# EAGLE design version1_3 (EAGLE 6.4)
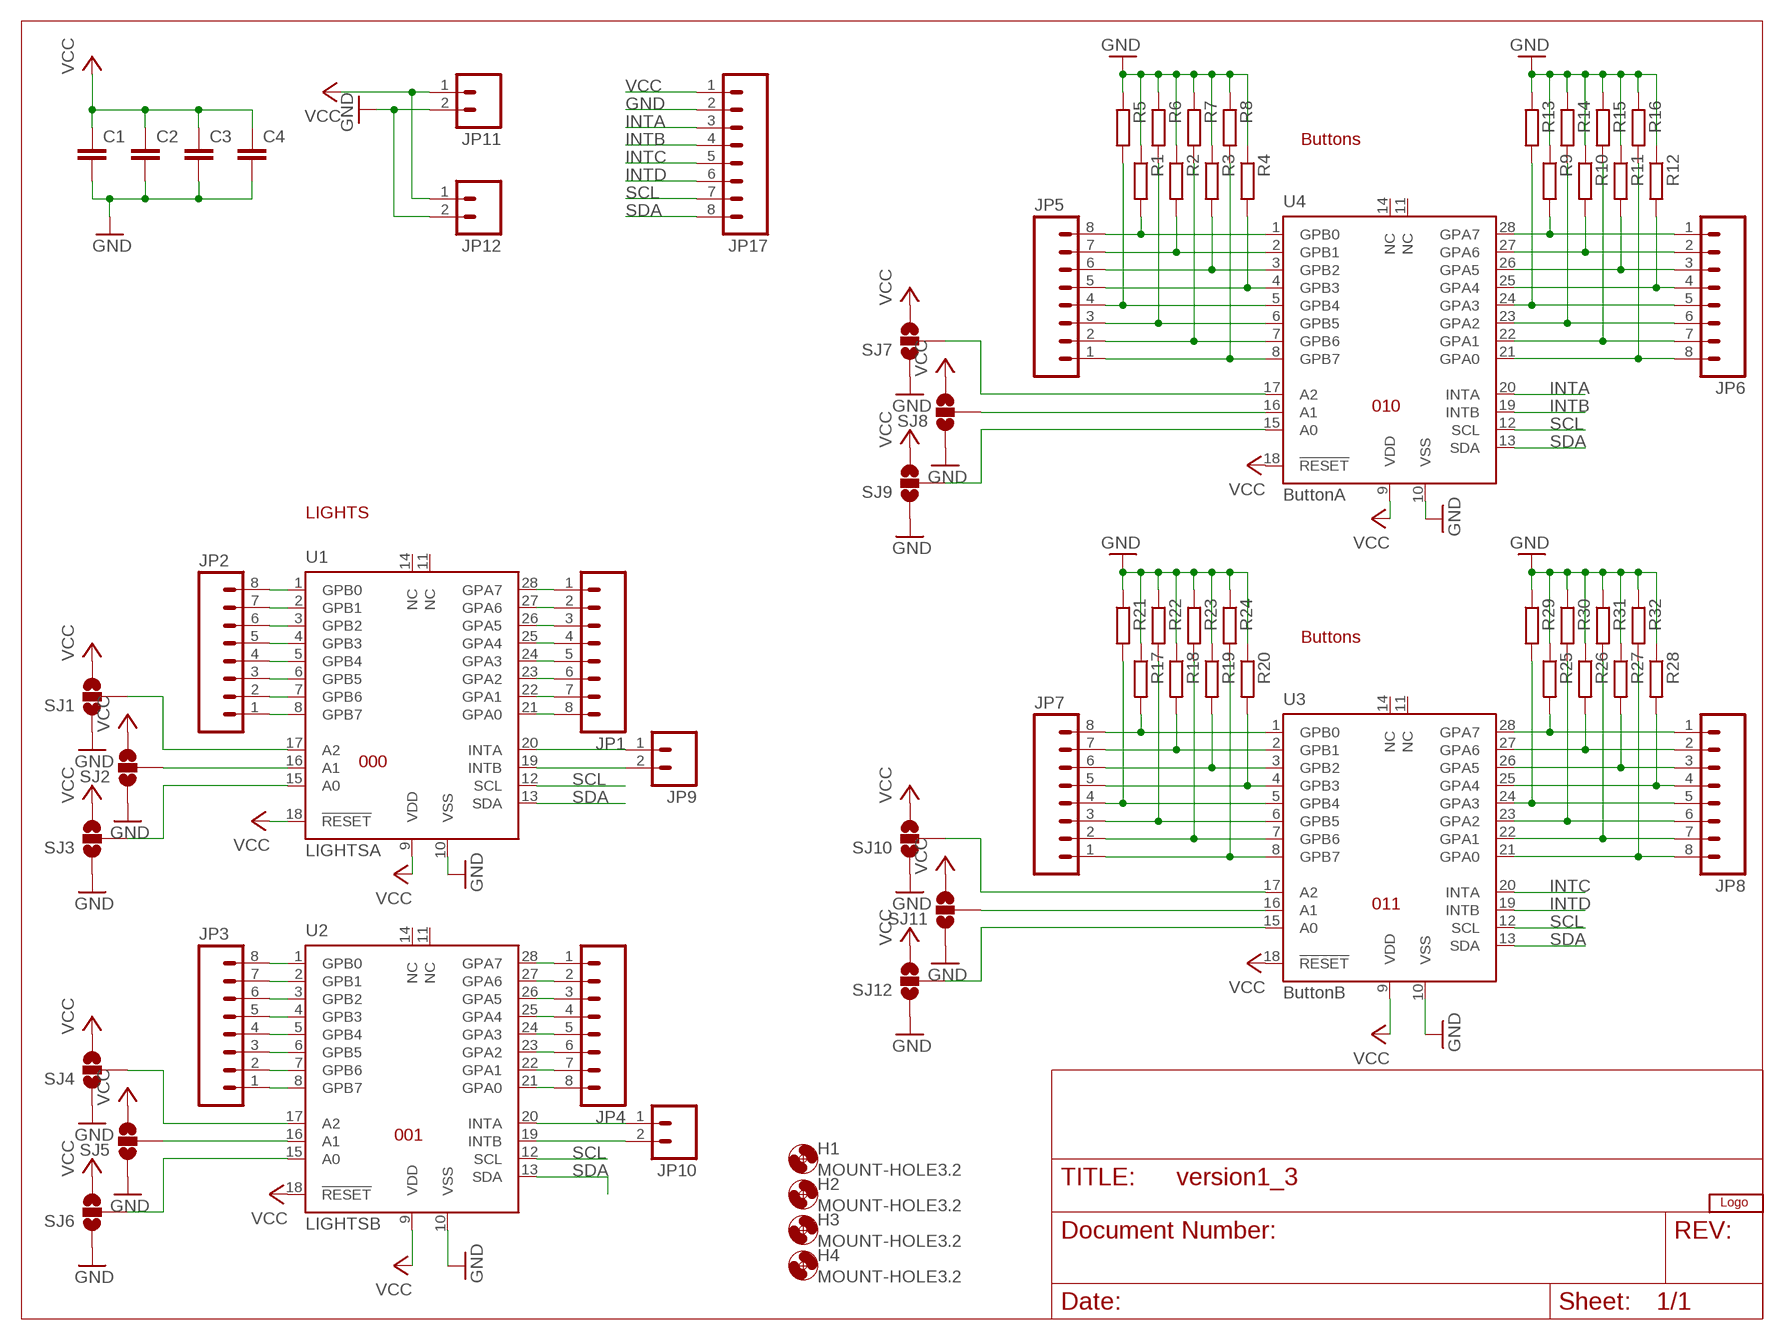
[diagram p0: schematic, sheet 1]

## Parts
C1  C-EUC0805  [C0805]
C2  C-EUC0805  [C0805]
C3  C-EUC0805  [C0805]
C4  C-EUC0805  [C0805]
H1  MOUNT-HOLE3.2  [3,2]
H2  MOUNT-HOLE3.2  [3,2]
H3  MOUNT-HOLE3.2  [3,2]
H4  MOUNT-HOLE3.2  [3,2]
JP1  M08LOCK  [1X08_LOCK]
JP2  M08LOCK  [1X08_LOCK]
JP3  M08LOCK  [1X08_LOCK]
JP4  M08LOCK  [1X08_LOCK]
JP5  M08LOCK  [1X08_LOCK]
JP6  M08LOCK  [1X08_LOCK]
JP7  M08LOCK  [1X08_LOCK]
JP8  M08LOCK  [1X08_LOCK]
JP9  M021X02_NO_SILK  [1X02_NO_SILK]
JP10  M021X02_NO_SILK  [1X02_NO_SILK]
JP11  M021X02_NO_SILK  [1X02_NO_SILK]
JP12  M021X02_NO_SILK  [1X02_NO_SILK]
JP17  M08LOCK  [1X08_LOCK]
R1  R-EU_R0805  [R0805]
R2  R-EU_R0805  [R0805]
R3  R-EU_R0805  [R0805]
R4  R-EU_R0805  [R0805]
R5  R-EU_R0805  [R0805]
R6  R-EU_R0805  [R0805]
R7  R-EU_R0805  [R0805]
R8  R-EU_R0805  [R0805]
R9  R-EU_R0805  [R0805]
R10  R-EU_R0805  [R0805]
R11  R-EU_R0805  [R0805]
R12  R-EU_R0805  [R0805]
R13  R-EU_R0805  [R0805]
R14  R-EU_R0805  [R0805]
R15  R-EU_R0805  [R0805]
R16  R-EU_R0805  [R0805]
R17  R-EU_R0805  [R0805]
R18  R-EU_R0805  [R0805]
R19  R-EU_R0805  [R0805]
R20  R-EU_R0805  [R0805]
R21  R-EU_R0805  [R0805]
R22  R-EU_R0805  [R0805]
R23  R-EU_R0805  [R0805]
R24  R-EU_R0805  [R0805]
R25  R-EU_R0805  [R0805]
R26  R-EU_R0805  [R0805]
R27  R-EU_R0805  [R0805]
R28  R-EU_R0805  [R0805]
R29  R-EU_R0805  [R0805]
R30  R-EU_R0805  [R0805]
R31  R-EU_R0805  [R0805]
R32  R-EU_R0805  [R0805]
SJ1  SOLDERJUMPER_2WAY-OLDS  [SJ_3]
SJ2  SOLDERJUMPER_2WAY-OLDS  [SJ_3]
SJ3  SOLDERJUMPER_2WAY-OLDS  [SJ_3]
SJ4  SOLDERJUMPER_2WAY-OLDS  [SJ_3]
SJ5  SOLDERJUMPER_2WAY-OLDS  [SJ_3]
SJ6  SOLDERJUMPER_2WAY-OLDS  [SJ_3]
SJ7  SOLDERJUMPER_2WAY-OLDS  [SJ_3]
SJ8  SOLDERJUMPER_2WAY-OLDS  [SJ_3]
SJ9  SOLDERJUMPER_2WAY-OLDS  [SJ_3]
SJ10  SOLDERJUMPER_2WAY-OLDS  [SJ_3]
SJ11  SOLDERJUMPER_2WAY-OLDS  [SJ_3]
SJ12  SOLDERJUMPER_2WAY-OLDS  [SJ_3]
U1  LIGHTSA  MCP23017A  [MCP23017A]
U2  LIGHTSB  MCP23017A  [MCP23017A]
U3  ButtonB  MCP23017A  [MCP23017A]
U4  ButtonA  MCP23017A  [MCP23017A]
U$1  BUNNYLOGOCALVIN2  [CALVIN2]

## Nets
GND [power]: C1.2 C2.2 C3.2 C4.2 JP11.2 JP12.2 JP17.2 R1.1 R2.1 R3.1 R4.1 R5.1 R6.1 R7.1 R8.1 R9.1 R10.1 R11.1 R12.1 R13.1 R14.1 R15.1 R16.1 R17.1 R18.1 R19.1 R20.1 R21.1 R22.1 R23.1 R24.1 R25.1 R26.1 R27.1 R28.1 R29.1 R30.1 R31.1 R32.1 SJ1.1 SJ2.1 SJ3.1 SJ4.1 SJ5.1 SJ6.1 SJ7.1 SJ8.1 SJ9.1 SJ10.1 SJ11.1 SJ12.1 U1.10(VSS) U2.10(VSS) U3.10(VSS) U4.10(VSS)
INTA: JP17.3 U4.20(INTA)
INTB: JP17.4 U4.19(INTB)
INTC: JP17.5 U3.20(INTA)
INTD: JP17.6 U3.19(INTB)
N$1: JP1.1 U1.28(GPA7)
N$2: JP1.2 U1.27(GPA6)
N$3: JP1.3 U1.26(GPA5)
N$4: JP1.4 U1.25(GPA4)
N$5: JP1.5 U1.24(GPA3)
N$6: JP1.6 U1.23(GPA2)
N$7: JP1.7 U1.22(GPA1)
N$8: JP1.8 U1.21(GPA0)
N$9: JP2.1 U1.8(GPB7)
N$10: JP2.2 U1.7(GPB6)
N$11: JP2.3 U1.6(GPB5)
N$12: JP2.4 U1.5(GPB4)
N$13: JP2.5 U1.4(GPB3)
N$14: JP2.6 U1.3(GPB2)
N$15: JP2.7 U1.2(GPB1)
N$16: JP2.8 U1.1(GPB0)
N$17: JP3.1 U2.8(GPB7)
N$18: JP3.2 U2.7(GPB6)
N$19: JP3.3 U2.6(GPB5)
N$20: JP3.4 U2.5(GPB4)
N$21: JP3.5 U2.4(GPB3)
N$22: JP3.6 U2.3(GPB2)
N$23: JP3.7 U2.2(GPB1)
N$24: JP3.8 U2.1(GPB0)
N$25: JP4.1 U2.28(GPA7)
N$26: JP4.2 U2.27(GPA6)
N$27: JP4.3 U2.26(GPA5)
N$28: JP4.4 U2.25(GPA4)
N$29: JP4.5 U2.24(GPA3)
N$30: JP4.6 U2.23(GPA2)
N$31: JP4.7 U2.22(GPA1)
N$32: JP4.8 U2.21(GPA0)
N$33: JP5.1 R8.2 U4.8(GPB7)
N$34: JP5.2 R7.2 U4.7(GPB6)
N$35: JP5.3 R6.2 U4.6(GPB5)
N$36: JP5.4 R5.2 U4.5(GPB4)
N$37: JP5.5 R4.2 U4.4(GPB3)
N$38: JP5.6 R3.2 U4.3(GPB2)
N$39: JP5.7 R2.2 U4.2(GPB1)
N$40: JP5.8 R1.2 U4.1(GPB0)
N$41: JP6.1 R9.2 U4.28(GPA7)
N$42: JP6.2 R10.2 U4.27(GPA6)
N$43: JP6.3 R11.2 U4.26(GPA5)
N$44: JP6.4 R12.2 U4.25(GPA4)
N$45: JP6.5 R13.2 U4.24(GPA3)
N$46: JP6.6 R14.2 U4.23(GPA2)
N$47: JP6.7 R15.2 U4.22(GPA1)
N$48: JP6.8 R16.2 U4.21(GPA0)
N$49: JP7.1 R24.2 U3.8(GPB7)
N$50: JP7.2 R23.2 U3.7(GPB6)
N$51: JP7.3 R22.2 U3.6(GPB5)
N$52: JP7.4 R21.2 U3.5(GPB4)
N$53: JP7.5 R20.2 U3.4(GPB3)
N$54: JP7.6 R19.2 U3.3(GPB2)
N$55: JP7.7 R18.2 U3.2(GPB1)
N$56: JP7.8 R17.2 U3.1(GPB0)
N$57: JP8.1 R25.2 U3.28(GPA7)
N$58: JP8.2 R26.2 U3.27(GPA6)
N$59: JP8.3 R27.2 U3.26(GPA5)
N$60: JP8.4 R28.2 U3.25(GPA4)
N$61: JP8.5 R29.2 U3.24(GPA3)
N$62: JP8.6 R30.2 U3.23(GPA2)
N$63: JP8.7 R31.2 U3.22(GPA1)
N$64: JP8.8 R32.2 U3.21(GPA0)
N$67: JP10.1 U2.20(INTA)
N$68: JP10.2 U2.19(INTB)
N$69: JP9.1 U1.20(INTA)
N$70: JP9.2 U1.19(INTB)
N$71: SJ4.2 U2.17(A2)
N$72: SJ5.2 U2.16(A1)
N$73: SJ6.2 U2.15(A0)
N$74: SJ10.2 U3.17(A2)
N$75: SJ11.2 U3.16(A1)
N$76: SJ12.2 U3.15(A0)
N$77: SJ2.2 U1.16(A1)
N$78: SJ3.2 U1.15(A0)
N$79: SJ1.2 U1.17(A2)
N$80: SJ7.2 U4.17(A2)
N$81: SJ8.2 U4.16(A1)
N$82: SJ9.2 U4.15(A0)
SCL: JP17.7 U1.12(SCL) U2.12(SCL) U3.12(SCL) U4.12(SCL)
SDA: JP17.8 U1.13(SDA) U2.13(SDA) U3.13(SDA) U4.13(SDA)
VCC [power]: C1.1 C2.1 C3.1 C4.1 JP11.1 JP12.1 JP17.1 SJ1.3 SJ2.3 SJ3.3 SJ4.3 SJ5.3 SJ6.3 SJ7.3 SJ8.3 SJ9.3 SJ10.3 SJ11.3 SJ12.3 U1.9(VDD) U1.18(!RESET) U2.9(VDD) U2.18(!RESET) U3.9(VDD) U3.18(!RESET) U4.9(VDD) U4.18(!RESET)
Unconnected: U1.11(NC) U1.14(NC) U2.11(NC) U2.14(NC) U3.11(NC) U3.14(NC) U4.11(NC) U4.14(NC)

## Notes on the sheet
- Buttons
- 010
- LIGHTS
- Buttons
- 000
- 011
- 001

## Library data of the parts
C1-C4 = rcl:C-EU: CAPACITOR, European symbol
H1-H4 = holes:MOUNT-HOLE: MOUNTING HOLE with drill center marker
JP1-JP8 JP17 = SparkFun:M08: Header 8 Standard 8-pin 0.1" header. Use with straight break away headers (SKU : PRT-00116), right angle break away headers (PRT-00553), swiss pins (PRT-00743), machine pins (PRT-00117), and female headers (PRT-00115).
JP9-JP12 = SparkFun:M02: Header 2 Standard 2-pin 0.1" header. Use with straight break away headers (SKU : PRT-00116), right angle break away headers (PRT-00553), swiss pins (PRT-00743), machine pins (PRT-00117), and female headers (PRT-00115). Molex polarized connector foot print use with SKU : PRT-08233 with associated crimp pins and housings.
R1-R32 = rcl:R-EU_: RESISTOR, European symbol
SJ1-SJ12 = SparkFun:SOLDERJUMPER_2WAY-OLD: Solder Jumper 2 way solder jumper
U1-U4 = brv_v6_2:MCP23017A: edit this description Auto generated by make-symbol-device-package-bsdl.ulp Rev. 43 Source:
U$1 = brv_v6_2:BUNNYLOGO

## Net classes
0 default: width 0.203 mm, drill 0.305 mm, clearance 0.203 mm
1 power: width 0.203 mm, drill 0.305 mm, clearance 0.203 mm

## Board
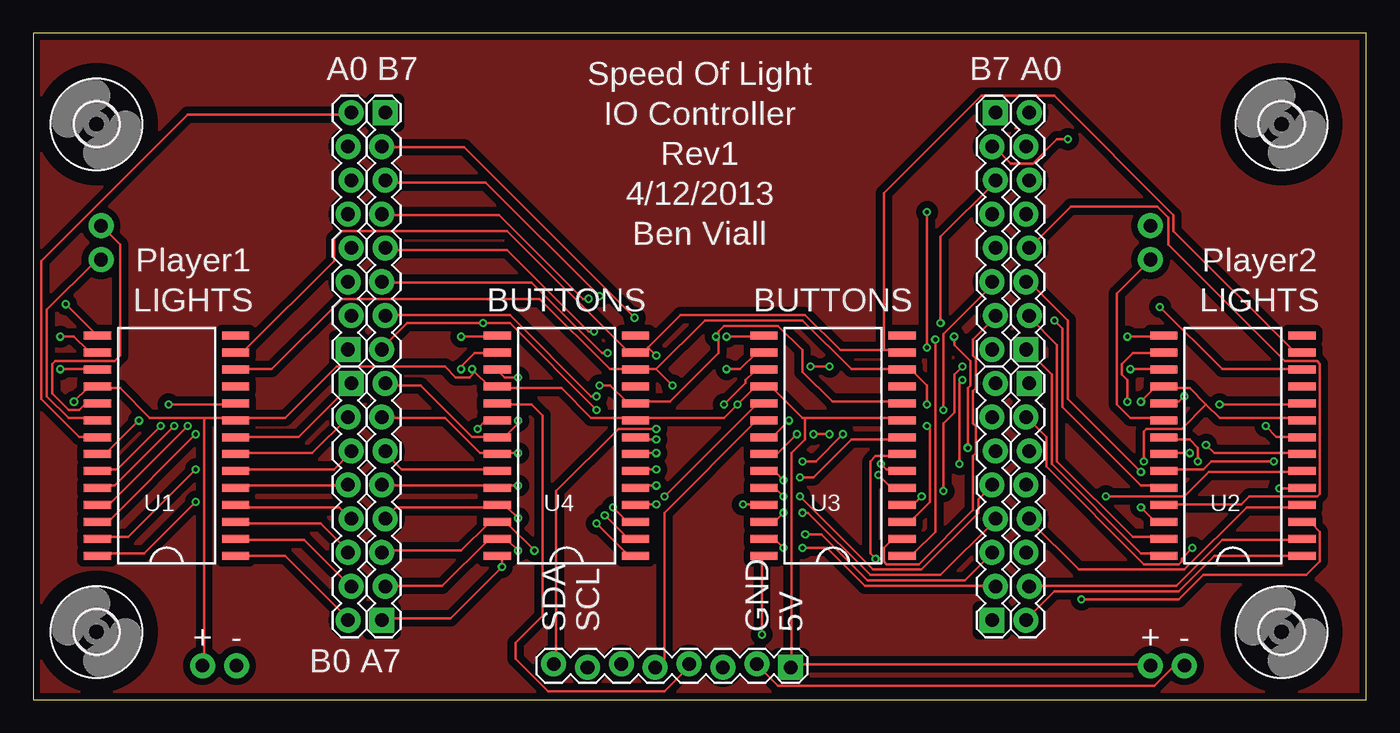
[diagram p1: board, top side]
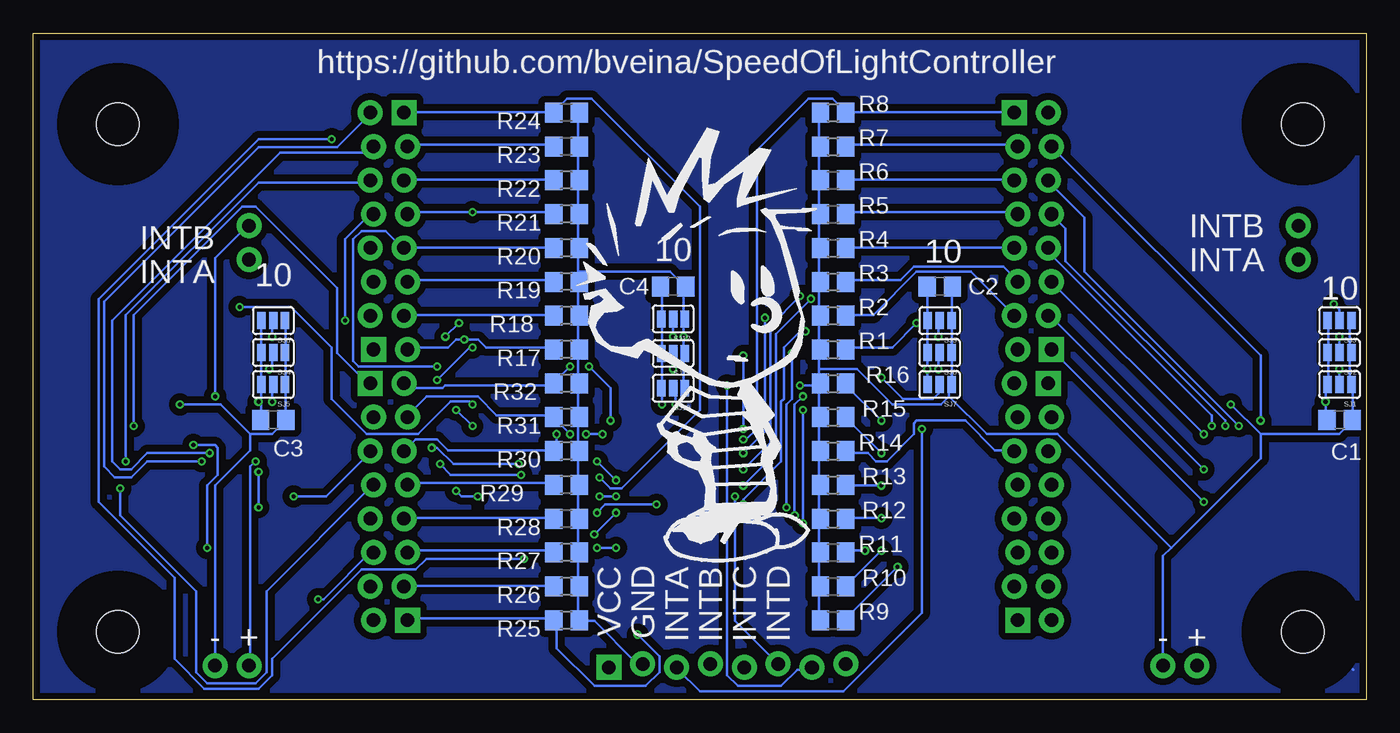
[diagram p2: board, bottom side, seen from below]

Size 100 x 50 mm. Coordinates in mm from the lower left corner, seen from the top.
Outline: 100,0 100,50 0,50 0,0 100,0
Copper layers (1*16): Top 0.035mm / dielectric 1.5mm / Bottom 0.035mm
Design rules "default": minimum track width 6mil, minimum drill 12mil, track to track 6mil, track to pad 6mil, pad to pad 6mil, via to via 6mil, smd to smd 0mil, copper to edge 10mil, drill to drill 10mil, minimum pad ring 10mil, minimum via ring 6mil, stop-mask expansion 2mil, vias tented up to drill 100mil, thermal gap 10mil

### Footprints (pad centres in the part's own frame; a part is rotated, then mirrored left to right if it is on the bottom)
C0805 = smd 1.3 x 1.5: 1 -0.95,0; 2 0.95,0
3,2 = hole 3.2: 0,0
1X08_LOCK = drill 1.016 pad 1.88 square: 1 0,0.127 | drill 1.016 pad 1.88: 2 2.54,-0.127; 3 5.08,0.127; 4 7.62,-0.127; 5 10.16,0.127; 6 12.7,-0.127; 7 15.24,0.127; 8 17.78,-0.127
1X02_NO_SILK = drill 1.016 pad 1.88: 1 0,0; 2 2.54,0
R0805 = smd 1.3 x 1.5: 1 -0.95,0; 2 0.95,0
SJ_3 = smd 0.635 x 1.27: 1 -0.889,0; 2 0,0; 3 0.889,0
MCP23017A = smd 2.05 x 0.6: 1 -5.177,8.255; 2 -5.177,6.985; 3 -5.177,5.715; 4 -5.177,4.445; 5 -5.177,3.175; 6 -5.177,1.905; 7 -5.177,0.635; 8 -5.177,-0.635; 9 -5.177,-1.905; 10 -5.177,-3.175; 11 -5.177,-4.445; 12 -5.177,-5.715; 13 -5.177,-6.985; 14 -5.177,-8.255; 15 5.177,-8.255; 16 5.177,-6.985; 17 5.177,-5.715; 18 5.177,-4.445; 19 5.177,-3.175; 20 5.177,-1.905; 21 5.177,-0.635; 22 5.177,0.635; 23 5.177,1.905; 24 5.177,3.175; 25 5.177,4.445; 26 5.177,5.715; 27 5.177,6.985; 28 5.177,8.255

### Placement (x,y rotation side)
C1  2,21 0 bottom
C2  32,31 0 bottom
C3  82,21 0 bottom
C4  52,31 0 bottom
H1  93.65,5.08 90 top
H2  93.65,43.18 90 top
H3  4.75,43.18 90 top
H4  4.75,5.08 90 top
JP1  23.73,26.27 90 top
JP2  23.73,23.73 270 top
JP3  74.6,23.73 270 top
JP4  74.6,26.27 90 top
JP5  26.27,44.05 270 top
JP6  26.27,5.95 90 top
JP7  72.06,44.05 270 top
JP8  72.06,5.95 90 top
JP9  5.08,33.02 90 top
JP10  83.82,33.02 90 top
JP11  12.7,2.54 0 top
JP12  83.82,2.54 0 top
JP17  56.82,2.54 180 top
R1  40,26.27 0 bottom
R2  40,28.81 0 bottom
R3  40,31.35 0 bottom
R4  40,33.89 0 bottom
R5  40,36.43 0 bottom
R6  40,38.97 0 bottom
R7  40,41.51 0 bottom
R8  40,44.05 0 bottom
R9  40,5.95 0 bottom
R10  40,8.49 0 bottom
R11  40,11.03 0 bottom
R12  40,13.57 0 bottom
R13  40,16.11 0 bottom
R14  40,18.65 0 bottom
R15  40,21.19 0 bottom
R16  40,23.73 0 bottom
R17  60,26.27 180 bottom
R18  60,28.81 180 bottom
R19  60,31.35 180 bottom
R20  60,33.89 180 bottom
R21  60,36.43 180 bottom
R22  60,38.97 180 bottom
R23  60,41.51 180 bottom
R24  60,44.05 180 bottom
R25  60,5.95 180 bottom
R26  60,8.49 180 bottom
R27  60,11.03 180 bottom
R28  60,13.57 180 bottom
R29  60,16.11 180 bottom
R30  60,18.65 180 bottom
R31  60,21.19 180 bottom
R32  60,23.73 180 bottom
SJ1  2,23.64 180 bottom
SJ2  2,26.04 180 bottom
SJ3  2,28.43 180 bottom
SJ4  82,26.04 180 bottom
SJ5  82,23.64 180 bottom
SJ6  82,28.43 180 bottom
SJ7  32,23.64 180 bottom
SJ8  32,26.04 180 bottom
SJ9  32,28.43 180 bottom
SJ10  52,23.36 180 bottom
SJ11  52,25.96 180 bottom
SJ12  52,28.57 180 bottom
U1  10,19.05 180 top
U2  90,19.05 180 top
U3  60,19.05 180 top
U4  40,19.05 180 top
U$1  59.87,9.42 0 bottom

### Tracks (layer width: path | path; a pad name or v marks a point on that pad's centre or on a via)
GND  (via drill 0.3)
  Top 0.203: v10.16,22.15 15.04,22.15 U1.10 | v89,22.15 95.1,22.15 U2.10 | 51.41,27.23 51.41,27.64 51.82,28.04 55.88,28.04 57.71,26.21 57.71,24.59 59.94,22.35 65.02,22.35 U3.10 | 51.41,27.23 51.41,26.01 47.75,22.35 45.31,22.35 U4.10 45.11,22.35 44.5,22.35 43.28,23.57 v42.47,23.57 | v51.21,27.23 51.41,27.23 | JP12.2 86.36,2.44 85.55,2.44 84.12,1.02 55.88,1.02 54.25,2.64 JP17.2
  Bottom 0.203: SJ3.1 1.22,28.25 1.22,26.21 SJ2.1 1.22,26.01 1.22,23.77 SJ1.1 1.02,23.57 1.02,21.13 C1.2 1.02,20.93 2.03,19.91 7.92,19.91 | 7.92,19.91 v10.16,22.15 | 14.63,11.38 7.92,18.09 7.92,19.91 | 14.63,11.38 15.24,10.77 15.24,2.64 JP11.2 | C2.2 31.09,30.89 31.09,28.45 SJ9.1 31.09,28.25 31.09,26.21 SJ8.1 31.09,26.01 31.09,23.77 SJ7.1 31.29,23.57 31.29,22.76 | R8.1 41.05,43.89 41.05,41.66 R7.1 41.05,41.45 41.05,39.01 R6.1 41.05,38.81 41.05,36.58 R5.1 41.05,36.37 41.05,33.93 R4.1 41.05,33.73 41.05,31.5 R3.1 41.05,31.29 41.05,28.85 R2.1 41.05,28.65 41.05,26.42 R1.1 41.05,26.21 41.05,24.79 | 41.05,23.57 41.05,21.34 R15.1 41.05,21.13 41.05,18.69 R14.1 41.05,18.49 41.05,16.26 R13.1 41.05,16.05 41.05,13.61 R12.1 41.05,13.41 41.05,11.18 R11.1 41.05,10.97 41.05,8.53 R10.1 41.05,8.33 41.05,6.1 R9.1 | 41.05,23.57 R16.1 | 41.05,24.79 41.05,23.77 R16.1 | 31.29,22.76 31.9,22.15 35.56,22.15 38.2,24.79 41.05,24.79 | 14.63,11.38 23.16,19.91 28.45,19.91 31.29,22.76 | SJ6.1 81.08,28.25 81.08,26.21 SJ4.1 81.08,26.01 81.08,23.77 SJ5.1 81.08,23.57 81.08,21.13 C3.2 81.08,20.93 82.09,19.91 83.72,19.91 | v89,22.15 85.95,22.15 83.72,19.91 | 83.72,19.91 83.72,18.69 86.36,16.05 86.36,2.64 JP12.2 | SJ10.1 51.21,23.37 51.21,25.81 SJ11.1 51.21,26.01 v51.21,27.23 51.21,28.45 SJ12.1 51.21,28.65 51.21,30.89 C4.2 51.21,31.09 52.22,32.11 59.13,32.11 | R24.1 59.13,43.89 59.13,41.66 R23.1 59.13,41.45 59.13,39.01 R22.1 59.13,38.81 59.13,36.58 R21.1 59.13,36.37 59.13,33.93 R20.1 59.13,33.73 59.13,32.11 | 59.13,32.11 59.13,31.5 R19.1 59.13,31.29 59.13,28.85 R18.1 59.13,28.65 59.13,26.42 R17.1 59.13,26.21 59.13,23.77 R32.1 59.13,23.57 59.13,21.34 R31.1 59.13,21.13 59.13,18.69 R30.1 59.13,18.49 59.13,16.26 R29.1 59.13,16.05 59.13,13.61 R28.1 59.13,13.41 59.13,11.18 R27.1 59.13,10.97 59.13,8.53 R26.1 59.13,8.33 59.13,6.1 R25.1 58.93,5.89 57.91,5.89 54.86,2.85 54.46,2.85 JP17.2
  Bottom 0.203: v42.47,23.57 41.05,23.57 | 41.05,23.57 R16.1
INTA  (via drill 0.3)
  Top 0.203: v33.33,20.32 33.93,20.93 34.75,20.93 U4.20
  Bottom 0.203: v33.33,20.32 33.33,6.5 39.22,0.61 49.99,0.61 51.61,2.23 JP17.3
INTB
  Top 0.203: U4.19 34.95,22.15 37.39,22.15 38.2,21.34 38.2,6.3 36.17,4.27 36.17,3.05 38.61,0.61 47.35,0.61 49.38,2.64 JP17.4
INTC
  Top 0.203: U3.20 54.66,20.93 54.25,20.93 47.35,14.02 47.35,3.05 46.74,2.44 JP17.5
INTD  (via drill 0.3)
  Top 0.203: v47.35,15.24 54.25,22.15 54.66,22.15 U3.19
  Bottom 0.203: v47.35,15.24 47.35,5.89 44.3,2.85 JP17.6
N$1  (via drill 0.3)
  Top 0.203: v12.19,14.83 8.33,10.97 4.88,10.97 U1.28
  Bottom 0.203: v12.19,14.83 23.57,26.21 JP1.1
N$2  (via drill 0.3)
  Top 0.203: v12.19,17.27 7.11,12.19 4.88,12.19 U1.27
  Bottom 0.203: v12.19,17.27 23.77,28.85 JP1.2
N$3  (via drill 0.3)
  Top 0.203: v12.19,19.91 5.69,13.41 4.88,13.41 U1.26
  Bottom 0.203: v12.19,19.91 23.57,31.29 JP1.3
N$4  (via drill 0.3)
  Top 0.203: v11.58,20.52 5.69,14.63 4.88,14.63 U1.25
  Bottom 0.203: v11.58,20.52 11.58,21.34 23.98,33.73 JP1.4
N$5  (via drill 0.3)
  Top 0.203: v10.57,20.52 6.1,16.05 4.88,16.05 U1.24
  Bottom 0.203: v10.57,20.52 10.57,20.93 22.55,32.92 22.55,35.36 23.57,36.37 JP1.5
N$6  (via drill 0.3)
  Top 0.203: v9.55,20.52 6.3,17.27 4.88,17.27 U1.23
  Bottom 0.203: v9.55,20.52 21.13,32.11 21.13,36.17 23.77,38.81 JP1.6
N$7  (via drill 0.3)
  Top 0.203: v7.92,20.93 5.49,18.49 4.88,18.49 U1.22
  Bottom 0.203: v7.92,20.93 7.92,25.81 23.57,41.45 JP1.7
N$8
  Top 0.203: U1.21 4.67,19.71 3.45,19.71 0.61,22.55 0.61,32.92 11.58,43.89 23.77,43.89 JP1.8
N$9
  Top 0.203: U1.8 15.24,19.71 19.91,19.71 23.77,23.57 JP2.1
N$10
  Top 0.203: U1.7 15.24,18.49 20.93,18.49 23.57,21.13 JP2.2
N$11
  Top 0.203: U1.6 15.24,17.27 22.55,17.27 23.77,18.49 JP2.3
N$12
  Top 0.203: U1.5 15.24,16.05 23.57,16.05 JP2.4
N$13
  Top 0.203: U1.4 15.24,14.43 22.96,14.43 23.77,13.61 JP2.5
N$14
  Top 0.203: U1.3 15.24,13.21 21.54,13.21 23.57,11.18 JP2.6
N$15
  Top 0.203: U1.2 15.24,11.99 20.32,11.99 23.77,8.53 JP2.7
N$16
  Top 0.203: U1.1 15.24,10.77 18.9,10.77 23.57,6.1 JP2.8
N$17  (via drill 0.3)
  Top 0.203: v92.46,20.52 93.27,19.71 95.1,19.71 U2.8
  Bottom 0.203: v92.46,20.52 92.46,28.85 84.33,36.98 83.31,36.98 77.22,30.89 77.22,26.01 74.78,23.57 JP3.1
N$18  (via drill 0.3)
  Top 0.203: v87.99,19.1 88.59,18.49 95.1,18.49 U2.7 | v86.97,11.38 86.16,10.57 86.16,10.36 85.95,10.16 83.31,10.16 76,17.48 76,19.71 74.57,21.13 JP3.2
  Bottom 0.203: v87.99,19.1 86.36,19.1 86.16,18.9 86.16,16.87 86.97,16.05 v86.97,11.38
N$19  (via drill 0.3)
  Top 0.203: v80.47,15.24 86.36,15.24 88.19,17.07 95.1,17.07 U2.6
  Bottom 0.203: v80.47,15.24 78.03,15.24 74.78,18.49 JP3.3
N$20  (via drill 0.3)
  Top 0.203: v93.47,15.85 95.1,15.85 U2.5
  Bottom 0.203: v93.47,15.85 93.47,13.82 87.78,8.13 87.78,2.03 86.97,1.22 83.31,1.22 82.5,2.03 82.5,8.13 74.57,16.05 JP3.4
N$21
  Top 0.203: U2.4 95.1,14.43 91.03,14.43 86.36,9.75 78.44,9.75 74.78,13.41 JP3.5
N$22  (via drill 0.3)
  Top 0.203: v78.64,7.52 85.95,7.52 87.78,9.35 95.5,9.35 96.52,10.36 96.52,12.6 95.91,13.21 95.3,13.21 U2.3
  Bottom 0.203: v78.64,7.52 78.23,7.52 74.57,11.18 JP3.6
N$23
  Top 0.203: U2.2 95.1,11.99 89.2,11.99 85.75,8.53 74.78,8.53 JP3.7
N$24
  Top 0.203: U2.1 95.1,10.77 88.59,10.77 85.95,8.13 76.61,8.13 74.57,6.1 JP3.8
N$25
  Top 0.203: U2.28 84.73,10.97 83.11,10.97 76.4,17.68 76.4,24.38 74.57,26.21 JP4.1
N$26
  Top 0.203: U2.27 84.73,12.19 82.5,12.19 76.81,17.88 76.81,26.62 74.78,28.65 JP4.2
N$27  (via drill 0.3)
  Top 0.203: v83.11,14.43 84.12,13.41 84.73,13.41 U2.26 | v83.11,17.07 77.62,22.55 77.62,28.45 74.57,31.5 JP4.3
  Bottom 0.203: v83.11,17.07 v83.11,14.43
N$28
  Top 0.203: U2.25 84.94,14.63 90.63,14.63 91.24,15.24 96.32,15.24 96.52,15.44 96.52,25.2 96.32,25.4 93.88,25.4 85.14,34.14 85.14,36.17 84.33,36.98 77.83,36.98 74.78,33.93 JP4.4
N$29  (via drill 0.3)
  Top 0.203: v76.61,28.45 77.22,27.84 77.22,21.95 83.11,16.05 84.73,16.05 U2.24
  Bottom 0.203: v76.61,28.45 76.61,34.54 74.57,36.58 JP4.5
N$30  (via drill 0.3)
  Top 0.203: v93.07,17.88 88.39,17.88 87.78,17.27 84.94,17.27 U2.23
  Bottom 0.203: v93.07,17.88 93.07,28.85 83.11,38.81 74.78,38.81 JP4.6
N$31  (via drill 0.3)
  Top 0.203: v86.77,18.49 84.94,18.49 U2.22
  Bottom 0.203: v86.77,18.49 91.44,18.49 92.66,17.27 93.47,17.27 94.08,17.88 94.08,28.45 81.48,41.05 74.98,41.05 74.57,41.45 JP4.7
N$32  (via drill 0.3)
  Top 0.203: v87.38,17.88 87.38,18.9 86.77,19.51 84.94,19.51 U2.21
  Bottom 0.203: v87.38,17.88 91.44,17.88 92.66,16.66 93.88,16.66 94.69,17.48 94.69,29.87 83.11,41.45 77.22,41.45 74.78,43.89 JP4.8
N$33  (via drill 0.3)
  Top 0.203: v46.74,19.51 45.31,19.51 U4.8
  Bottom 0.203: 39.01,44.09 26.42,44.09 JP5.1 | 39.01,44.09 R8.2 39.01,44.09 | v46.74,19.51 46.53,19.51 45.72,20.32 45.72,41.25 41.86,45.11 40.03,45.11 39.01,44.09
N$34  (via drill 0.3)
  Top 0.203: v46.74,18.49 45.31,18.49 U4.7 | v45.11,28.65 32.31,41.45 26.21,41.45 JP5.2
  Bottom 0.203: R7.2 39.01,41.66 26.21,41.66 JP5.2 | v46.74,18.49 45.11,20.12 v45.11,28.65
N$35  (via drill 0.3)
  Top 0.203: v46.74,17.27 45.31,17.27 U4.6 | v42.47,30.28 33.93,38.81 26.42,38.81 JP5.3
  Bottom 0.203: R6.2 39.01,39.01 26.42,39.01 JP5.3 | v46.74,17.27 44.7,19.3 44.7,28.04 v42.47,30.28
N$36  (via drill 0.3)
  Top 0.203: v46.74,16.05 45.31,16.05 U4.5 | v41.66,30.07 41.25,30.07 34.95,36.37 26.21,36.37 JP5.4
  Bottom 0.203: R5.2 39.01,36.58 26.21,36.58 JP5.4 | v46.74,16.05 44.3,18.49 44.3,27.43 v41.66,30.07
N$37  (via drill 0.3)
  Top 0.203: v46.74,14.63 45.31,14.63 U4.4 | v42.06,27.64 41.66,27.64 35.56,33.73 26.42,33.73 JP5.5
  Bottom 0.203: R4.2 39.01,33.93 26.42,33.93 JP5.5 | v46.74,14.63 46.74,15.04 43.89,17.88 43.89,22.35 43.69,22.55 43.69,26.42 42.47,27.64 v42.06,27.64
N$38  (via drill 0.3)
  Top 0.203: v43.48,14.43 44.5,13.41 45.11,13.41 U4.3 | v43.08,26.01 42.67,26.01 37.39,31.29 26.21,31.29 JP5.6
  Bottom 0.203: R3.2 39.01,31.5 34.95,31.5 33.93,32.51 27.23,32.51 26.21,31.5 JP5.6 | v43.48,14.43 43.48,22.15 43.08,22.55 v43.08,26.01
N$39  (via drill 0.3)
  Top 0.203: v42.88,13.82 44.5,12.19 45.11,12.19 U4.2 | v42.27,22.76 41.86,22.76 35.76,28.85 26.42,28.85 JP5.7
  Bottom 0.203: R2.2 39.01,28.85 36.98,28.85 33.73,32.11 29.67,32.11 26.42,28.85 JP5.7 | v42.88,13.82 42.88,22.15 v42.27,22.76
N$40  (via drill 0.3)
  Top 0.203: JP5.8 26.21,26.42 28.04,28.25 v33.73,28.25 35.76,28.25 v42.27,21.74 | v42.27,13.21 44.5,10.97 45.11,10.97 U4.1
  Bottom 0.203: v33.73,28.25 35.56,26.42 39.01,26.42 R1.2 | v42.27,21.74 v42.27,13.21
N$41  (via drill 0.3)
  Top 0.203: U4.28 34.95,10.77 35.15,10.57 v35.15,9.96 31.29,6.1 26.21,6.1 JP6.1
  Bottom 0.203: v35.15,9.96 39.01,6.1 R9.2
N$42  (via drill 0.3)
  Top 0.203: v36.37,11.18 35.56,11.99 34.95,11.99 U4.27 34.75,11.99 34.14,11.99 30.68,8.53 26.42,8.53 JP6.2
  Bottom 0.203: v36.37,11.18 39.01,8.53 R10.2
N$43  (via drill 0.3)
  Top 0.203: v37.59,11.18 35.56,13.21 34.95,13.21 U4.26 34.75,13.21 34.14,13.21 32.11,11.18 26.21,11.18 JP6.3
  Bottom 0.203: v37.59,11.18 39.01,11.18 R11.2
N$44  (via drill 0.3)
  Top 0.203: v36.37,13.61 35.56,14.43 34.95,14.43 U4.25 34.75,14.43 27.23,14.43 26.42,13.61 JP6.4
  Bottom 0.203: v36.37,13.61 39.01,13.61 R12.2
N$45  (via drill 0.3)
  Top 0.203: v36.37,16.05 34.95,16.05 U4.24 34.75,16.05 26.21,16.05 JP6.5
  Bottom 0.203: v36.37,16.05 39.01,16.05 R13.2
N$46
  Top 0.203: U4.23 34.75,17.27 27.64,17.27 26.42,18.49 JP6.6
  Bottom 0.203: R14.2 39.01,18.49 37.39,18.49 36.78,17.88 35.97,17.88 33.93,19.91 33.93,20.73 33.73,20.93 30.07,20.93 27.84,18.69 26.42,18.69 JP6.6
N$47  (via drill 0.3)
  Top 0.203: v36.37,18.49 34.95,18.49 U4.22 34.75,18.49 33.53,18.49 30.89,21.13 26.21,21.13 JP6.7
  Bottom 0.203: v36.37,18.49 39.01,21.13 R15.2
N$48  (via drill 0.3)
  Top 0.203: v36.37,20.93 36.37,20.73 35.36,19.71 34.95,19.71 U4.21 34.75,19.71 32.92,19.71 29.06,23.57 26.42,23.57 JP6.8
  Bottom 0.203: v36.37,20.93 39.01,23.57 R16.2
N$49  (via drill 0.3)
  Top 0.203: v57.51,16.66 58.52,16.66 61.37,19.51 65.02,19.51 U3.8
  Bottom 0.203: 60.96,44.09 72.14,44.09 JP7.1 | 60.96,44.09 R24.2 60.96,44.09 | v57.51,16.66 56.69,15.85 55.88,15.85 49.99,21.74 49.99,36.98 58.12,45.11 59.94,45.11 60.96,44.09
N$50  (via drill 0.3)
  Top 0.203: v63.2,10.57 62.79,10.97 62.79,17.88 63.2,18.29 65.02,18.29 U3.7 | v77.62,42.06 76.81,42.06 74.98,40.23 73.36,40.23 72.14,41.45 JP7.2
  Bottom 0.203: R23.2 60.96,41.66 71.93,41.66 JP7.2 | v63.2,10.57 70.51,10.57 71.32,9.75 75.39,9.75 82.09,3.05 82.09,1.83 83.11,0.81 87.17,0.81 89.41,3.05 89.41,9.14 95.1,14.83 95.1,30.07 83.11,42.06 v77.62,42.06
N$51  (via drill 0.3)
  Top 0.203: v63.6,17.68 64.01,17.27 65.02,17.27 U3.6 | v70.1,18.9 70.1,23.37 70.31,23.57 70.31,25.4 69.09,26.62 v69.09,27.23 | v68.07,28.25 68.07,34.75 72.14,38.81 JP7.3
  Bottom 0.203: R22.2 60.96,39.01 72.14,39.01 JP7.3 | v63.6,17.68 68.48,17.68 69.7,18.9 v70.1,18.9 | v68.07,28.25 v69.09,27.23
N$52  (via drill 0.3)
  Top 0.203: v63.4,16.87 64.21,16.05 65.02,16.05 U3.5 | v69.49,17.68 69.49,23.77 v69.7,23.98 | v67.06,36.58 v67.06,26.42
  Bottom 0.203: R21.2 60.96,36.58 v67.06,36.58 71.93,36.58 JP7.4 | v63.4,16.87 68.68,16.87 v69.49,17.68 | v69.7,23.98 67.26,26.42 v67.06,26.42
N$53  (via drill 0.3)
  Top 0.203: v66.65,15.24 66.04,14.63 65.23,14.63 U3.4 | v68.28,15.65 68.28,20.73 69.09,21.54 69.09,24.38 v69.7,24.99
  Bottom 0.203: R20.2 60.96,33.93 72.14,33.93 JP7.5 72.34,33.93 73.56,35.15 75.39,35.15 76,34.54 76,25.4 75.59,24.99 v69.7,24.99 | v66.65,15.24 67.87,15.24 v68.28,15.65
N$54  (via drill 0.3)
  Top 0.203: v67.06,20.52 67.26,20.32 67.26,14.83 65.84,13.41 65.23,13.41 U3.3 | v68.28,21.74 68.28,27.43 72.14,31.29 JP7.6
  Bottom 0.203: R19.2 60.96,31.5 71.93,31.5 JP7.6 | v68.28,21.74 v67.06,20.52
N$55
  Top 0.203: U3.2 65.02,11.99 64.41,11.99 63.8,11.38 63.8,10.36 64.01,10.16 66.45,10.16 70.51,14.22 70.51,18.29 70.71,18.49 70.71,20.52 70.51,20.73 70.51,23.16 70.71,23.37 70.71,25.6 70.51,25.81 70.51,27.03 72.14,28.65 JP7.7
  Bottom 0.203: R18.2 60.96,28.85 72.14,28.85 JP7.7
N$56  (via drill 0.3)
  Top 0.203: v67.67,27.03 67.67,12.6 66.04,10.97 65.23,10.97 U3.1
  Bottom 0.203: R17.2 60.96,26.42 66.04,26.42 66.65,27.03 v67.67,27.03 68.28,27.03 68.89,26.42 71.93,26.42 JP7.8
N$57  (via drill 0.3)
  Top 0.203: v54.66,4.88 54.66,10.77 U3.28
  Bottom 0.203: JP8.1 71.93,6.1 60.96,6.1 R25.2 60.76,5.89 60.76,3.86 57.91,1.02 54.05,1.02 53.03,2.03 53.03,3.25 v54.66,4.88
N$58  (via drill 0.3)
  Top 0.203: v56.29,11.38 55.68,11.99 54.86,11.99 U3.27 | v57.71,11.38 59.54,11.38 62.38,8.53 72.14,8.53 JP8.2
  Bottom 0.203: R26.2 60.96,8.53 72.14,8.53 JP8.2 | v57.71,11.38 v56.29,11.38
N$59  (via drill 0.3)
  Top 0.203: v56.29,14.02 55.68,13.41 54.86,13.41 U3.26 | v57.91,12.39 59.13,12.39 62.59,8.94 69.9,8.94 71.93,10.97 JP8.3
  Bottom 0.203: R27.2 60.96,11.18 71.93,11.18 JP8.3 | v57.91,12.39 v56.29,14.02
N$60  (via drill 0.3)
  Top 0.203: v53.24,14.63 54.66,14.63 U3.25 | v57.71,14.02 58.12,14.02 62.79,9.35 68.07,9.35 72.14,13.41 JP8.4
  Bottom 0.203: R28.2 60.96,13.61 72.14,13.61 JP8.4 | v53.24,14.63 57.1,14.63 v57.71,14.02
N$61  (via drill 0.3)
  Top 0.203: v56.29,15.24 55.68,15.85 54.86,15.85 U3.24 | v57.51,15.24 62.99,9.75 66.65,9.75 70.92,14.02 70.92,15.04 71.93,16.05 JP8.5
  Bottom 0.203: R29.2 60.96,16.26 71.93,16.26 JP8.5 | v57.51,15.24 v56.29,15.24
N$62  (via drill 0.3)
  Top 0.203: v56.29,16.46 55.68,17.07 54.86,17.07 U3.23 | v57.71,17.88 58.73,17.88 v60.76,19.91
  Bottom 0.203: JP8.6 72.14,18.69 71.32,19.51 69.7,19.51 68.89,18.69 60.96,18.69 R30.2 60.76,18.69 v60.76,19.91 | v57.71,17.88 v56.29,16.46
N$63  (via drill 0.3)
  Top 0.203: v57.3,19.91 55.88,18.49 54.86,18.49 U3.22 | v59.74,19.91 v58.52,19.91
  Bottom 0.203: JP8.7 71.93,21.34 70.51,22.76 66.65,22.76 65.23,21.34 60.96,21.34 R31.2 60.96,21.13 v59.74,19.91 | v58.52,19.91 v57.3,19.91
N$64  (via drill 0.3)
  Top 0.203: v56.69,20.93 55.47,19.71 54.86,19.71 U3.21 | v59.74,24.99 v58.32,24.99
  Bottom 0.203: JP8.8 72.14,23.57 71.93,23.37 69.29,23.37 69.09,23.57 60.96,23.57 R32.2 60.96,23.77 v59.74,24.99 | v56.69,20.93 56.69,23.37 v58.32,24.99
N$65
  Top 0.203: 73.76,42.88 73.71,42.87 | 73.76,42.88 73.71,42.87 | 73.76,42.88 73.71,42.87 | 73.76,42.88 73.71,42.87 | 73.76,42.88 73.71,42.87 | 73.76,42.88 73.71,42.87 | 73.76,42.88 73.71,42.87 | 73.76,42.88 73.71,42.87 | 73.76,42.88 73.71,42.87 | 73.76,42.88 73.71,42.87 | 73.76,42.88 73.71,42.87 | 73.76,42.88 73.71,42.87 | 73.76,42.88 73.71,42.87 | 73.76,42.88 73.71,42.87 | 73.76,42.88 73.71,42.87 | 73.76,42.88 73.71,42.87 | 73.76,42.88 73.71,42.87 | 73.76,42.88 73.71,42.87 | 73.76,42.88 73.71,42.87 | 73.76,42.88 73.71,42.87 | 73.76,42.88 73.71,42.87 | 73.76,42.88 73.71,42.87 | 73.76,42.88 73.71,42.87 | 73.76,42.88 73.71,42.87 | 73.76,42.88 73.71,42.87 | 73.76,42.88 73.71,42.87 | 73.76,42.88 73.71,42.87 | 73.76,42.88 73.71,42.87 | 73.76,42.88 73.71,42.87 | 73.76,42.88 73.71,42.87 | 73.76,42.88 73.71,42.87 | 73.76,42.88 73.71,42.87 | 73.76,42.88 73.71,42.87 | 73.76,42.88 73.71,42.87 | 73.76,42.88 73.71,42.87 | 73.76,42.88 73.71,42.87 | 73.76,42.88 73.71,42.87 | 73.76,42.88 73.71,42.87 | 73.76,42.88 73.71,42.87 | 73.76,42.88 73.71,42.87 | 73.76,42.88 73.71,42.87 | 73.76,42.88 73.71,42.87 | 73.76,42.88 73.71,42.87 | 73.76,42.88 73.71,42.87 | 73.76,42.88 73.71,42.87 | 73.76,42.88 73.71,42.87 | 73.76,42.88 73.71,42.87 | 73.76,42.88 73.71,42.87 | 73.76,42.88 73.71,42.87 | 73.76,42.88 73.71,42.87 | 73.76,42.88 73.71,42.87 | 73.76,42.88 73.71,42.87 | 73.76,42.88 73.71,42.87 | 73.76,42.88 73.71,42.87 | 73.76,42.88 73.71,42.87 | 73.76,42.88 73.71,42.87 | 73.76,42.88 73.71,42.87 | 73.76,42.88 73.71,42.87 | 73.76,42.88 73.71,42.87 | 73.76,42.88 73.71,42.87 | 73.76,42.88 73.71,42.87 | 73.76,42.88 73.71,42.87 | 73.76,42.88 73.71,42.87 | 73.76,42.88 73.71,42.87 | 73.76,42.88 73.71,42.87 | 73.76,42.88 73.71,42.87
  Top 0.203: 73.76,42.88 73.71,42.87 | 73.76,42.88 73.71,42.87 | 73.76,42.88 73.71,42.87 | 73.76,42.88 73.71,42.87
  pour Top (isolate 0.508): 0,50 100,50 100,0 0,0
N$66
  Bottom 0.203: 1.02,2.29 0.96,2.23 | 1.02,2.29 0.96,2.23 | 1.02,2.29 0.96,2.23 | 1.02,2.29 0.96,2.23 | 1.02,2.29 0.96,2.23 | 1.02,2.29 0.96,2.23 | 1.02,2.29 0.96,2.23 | 1.02,2.29 0.96,2.23 | 1.02,2.29 0.96,2.23 | 1.02,2.29 0.96,2.23
  pour Bottom (isolate 0.508): 0,50 100,50 100,0 0,0
N$67
  Top 0.203: U2.20 84.73,21.13 82.3,21.13 81.28,22.15 81.28,30.48 83.72,32.92 JP10.1
N$68  (via drill 0.3)
  Top 0.203: v86.36,22.76 85.95,22.35 84.94,22.35 U2.19
  Bottom 0.203: v86.36,22.76 86.36,33.12 83.92,35.56 JP10.2
N$69
  Top 0.203: U1.20 4.67,21.13 2.64,21.13 1.02,22.76 1.02,29.26 4.67,32.92 5.08,32.92 JP9.1
N$70
  Top 0.203: JP9.2 6.5,34.14 6.5,25.81 6.1,25.4 1.63,25.4 1.42,25.2 1.42,22.96 2.64,21.74 3.45,21.74 3.86,22.15 4.67,22.15 U1.19
N$71  (via drill 0.3)
  Top 0.203: v82.3,24.79 84.73,24.79 U2.17
  Bottom 0.203: v82.3,24.79 82.09,24.99 82.09,26.01 SJ4.2
N$72  (via drill 0.3)
  Top 0.203: v82.09,22.35 82.09,23.98 81.69,24.38 81.69,25.2 82.5,26.01 84.73,26.01 U2.16
  Bottom 0.203: v82.09,22.35 82.09,23.57 SJ5.2
N$73  (via drill 0.3)
  Top 0.203: v82.09,27.23 84.73,27.23 U2.15
  Bottom 0.203: v82.09,27.23 82.09,28.25 SJ6.2
N$74  (via drill 0.3)
  Top 0.203: v51.82,22.15 53.44,23.77 53.44,23.98 54.05,24.59 54.66,24.59 U3.17
  Bottom 0.203: v51.82,22.15 51.82,23.16 SJ10.2
N$75  (via drill 0.3)
  Top 0.203: v52.02,24.79 53.03,24.79 54.25,26.01 54.66,26.01 U3.16
  Bottom 0.203: v52.02,24.79 52.02,25.81 SJ11.2
N$76  (via drill 0.3)
  Top 0.203: v52.02,27.23 54.66,27.23 U3.15
  Bottom 0.203: v52.02,27.23 52.02,28.45 SJ12.2
N$77  (via drill 0.3)
  Top 0.203: v2.03,27.23 3.05,27.23 4.06,26.21 4.67,26.21 U1.16
  Bottom 0.203: v2.03,27.23 2.03,26.21 SJ2.2
N$78  (via drill 0.3)
  Top 0.203: v2.44,29.67 4.67,27.43 U1.15
  Bottom 0.203: v2.44,29.67 2.03,29.26 2.03,28.45 SJ3.2
N$79  (via drill 0.3)
  Top 0.203: v2.03,24.79 4.67,24.79 U1.17
  Bottom 0.203: v2.03,24.79 2.03,23.77 SJ1.2
N$80  (via drill 0.3)
  Top 0.203: v36.37,24.18 35.36,24.18 34.95,24.59 U4.17
  Bottom 0.203: v36.37,24.18 34.75,22.55 32.51,22.55 32.11,22.96 32.11,23.57 SJ7.2
N$81  (via drill 0.3)
  Top 0.203: v32.11,24.79 32.11,24.99 33.12,26.01 34.75,26.01 U4.16
  Bottom 0.203: v32.11,24.79 32.11,26.01 SJ8.2
N$82  (via drill 0.3)
  Top 0.203: v32.11,27.23 34.75,27.23 U4.15
  Bottom 0.203: v32.11,27.23 32.11,28.25 SJ9.2
SCL  (via drill 0.3)
  Top 0.203: U1.12 15.24,24.79 17.88,24.79 23.16,30.07 38,30.07 43.28,24.79 45.11,24.79 U4.12 45.31,24.79 46.74,24.79 | 46.74,24.79 50.39,28.45 57.71,28.45 61.37,24.79 65.02,24.79 U3.12 65.23,24.59 66.04,24.59 67.06,23.57 v67.06,22.15 | v84.53,29.46 89.2,24.79 95.1,24.79 U2.12 | 46.74,24.79 v47.95,23.57
  Bottom 0.203: v84.53,29.46 80.67,29.46 77.62,26.42 77.62,22.55 74.98,19.91 71.12,19.91 68.68,22.35 67.26,22.35 v67.06,22.15 | v47.95,23.57 47.95,1.83 47.14,1.02 43.89,1.02 42.67,2.23 41.66,2.23 JP17.7
SDA  (via drill 0.3)
  Top 0.203: U1.13 15.24,26.21 15.85,26.21 22.55,32.92 22.55,34.54 23.16,35.15 35.56,35.15 44.5,26.21 45.11,26.21 U4.13 45.31,26.21 45.92,26.21 46.13,26.42 | 63.8,26.21 60.55,26.21 57.91,28.85 48.56,28.85 46.13,26.42 | 63.8,26.21 65.02,26.21 U3.13 | 63.8,26.21 63.8,38 71.12,45.31 76.61,45.31 85.55,36.37 85.55,35.15 94.49,26.21 95.1,26.21 U2.13 | v46.74,20.32 43.89,20.32 39.22,15.65 39.22,2.85 JP17.8 | 46.13,26.42 v46.74,25.81
  Bottom 0.203: v46.74,25.81 v46.74,20.32
VCC  (via drill 0.3)
  Top 0.203: 12.8,21.13 8.74,21.13 6.5,23.37 4.88,23.37 U1.18 4.67,23.37 4.06,23.37 v3.05,22.35 | 12.8,21.13 15.04,21.13 U1.9 15.24,21.13 18.9,21.13 22.76,24.99 30.89,24.99 31.7,24.18 32.72,24.18 33.12,24.59 | 12.8,21.13 12.8,2.64 JP11.1 | 87.99,22.15 86.77,23.37 84.94,23.37 U2.18 84.73,23.37 84.12,23.37 v83.11,22.35 | 87.99,22.15 89,21.13 95.1,21.13 U2.9 | 57.91,21.13 57.71,21.13 55.47,23.37 54.86,23.37 U3.18 54.66,23.37 54.05,23.37 v52.83,22.15 51.82,21.13 45.31,21.13 U4.9 45.11,21.13 41.86,21.13 39.62,23.37 34.95,23.37 U4.18 34.75,23.57 34.14,23.57 33.12,24.59 | 57.91,21.13 65.02,21.13 U3.9 | 56.9,2.64 56.9,18.49 57.91,19.51 57.91,21.13 | 56.9,2.64 56.9,2.44 JP17.1 56.9,2.64 | 56.9,2.64 83.72,2.64 JP12.1 | 33.12,24.59 v32.92,24.79 33.12,24.59 | 87.99,22.15 86.16,20.32 83.52,20.32 83.31,20.12 v83.31,17.88
  Bottom 0.203: SJ3.3 2.85,28.25 2.85,26.21 SJ2.3 2.85,26.01 2.85,23.77 SJ1.3 3.05,23.57 v3.05,22.35 3.05,21.13 C1.1 | SJ6.3 82.91,28.25 82.91,26.21 SJ4.3 82.91,26.01 82.91,23.77 SJ5.3 82.91,23.57 82.91,22.35 | 82.91,22.35 82.91,21.13 C3.1 | v83.11,22.35 82.91,22.35 | C4.1 52.83,30.89 52.83,28.65 SJ12.3 52.83,28.45 52.83,26.01 SJ11.3 52.83,25.81 52.83,23.37 SJ10.3 52.83,23.16 v52.83,22.15 | SJ7.3 32.92,23.77 v32.92,24.79 32.92,26.01 SJ8.3 32.92,26.21 32.92,28.25 SJ9.3 32.92,28.45 32.92,30.89 C2.1 | v83.31,17.88 83.72,17.48 83.72,2.64 JP12.1

### Text on the board
tPlace: A0 | B7 | B7 | A0 | Speed Of Light | IO Controller | Rev1 | 4/12/2013 | Ben Viall | Player1 | Player2 | LIGHTS | BUTTONS | BUTTONS | LIGHTS | SDA | SCL | GND | 5V | + | - | B0 | A7 | + | -
bPlace: https://github.com/bveina/SpeedOfLightController | INTB | INTB | INTA | 10 | 10 | INTA | 10 | 10 | GND | VCC | + | - | INTD | INTC | INTB | INTA | + | -
tDocu: A7 | B0 | + | -